# EasyEDA schematic GSE_Controller_Schematic25_EasyEDA.json
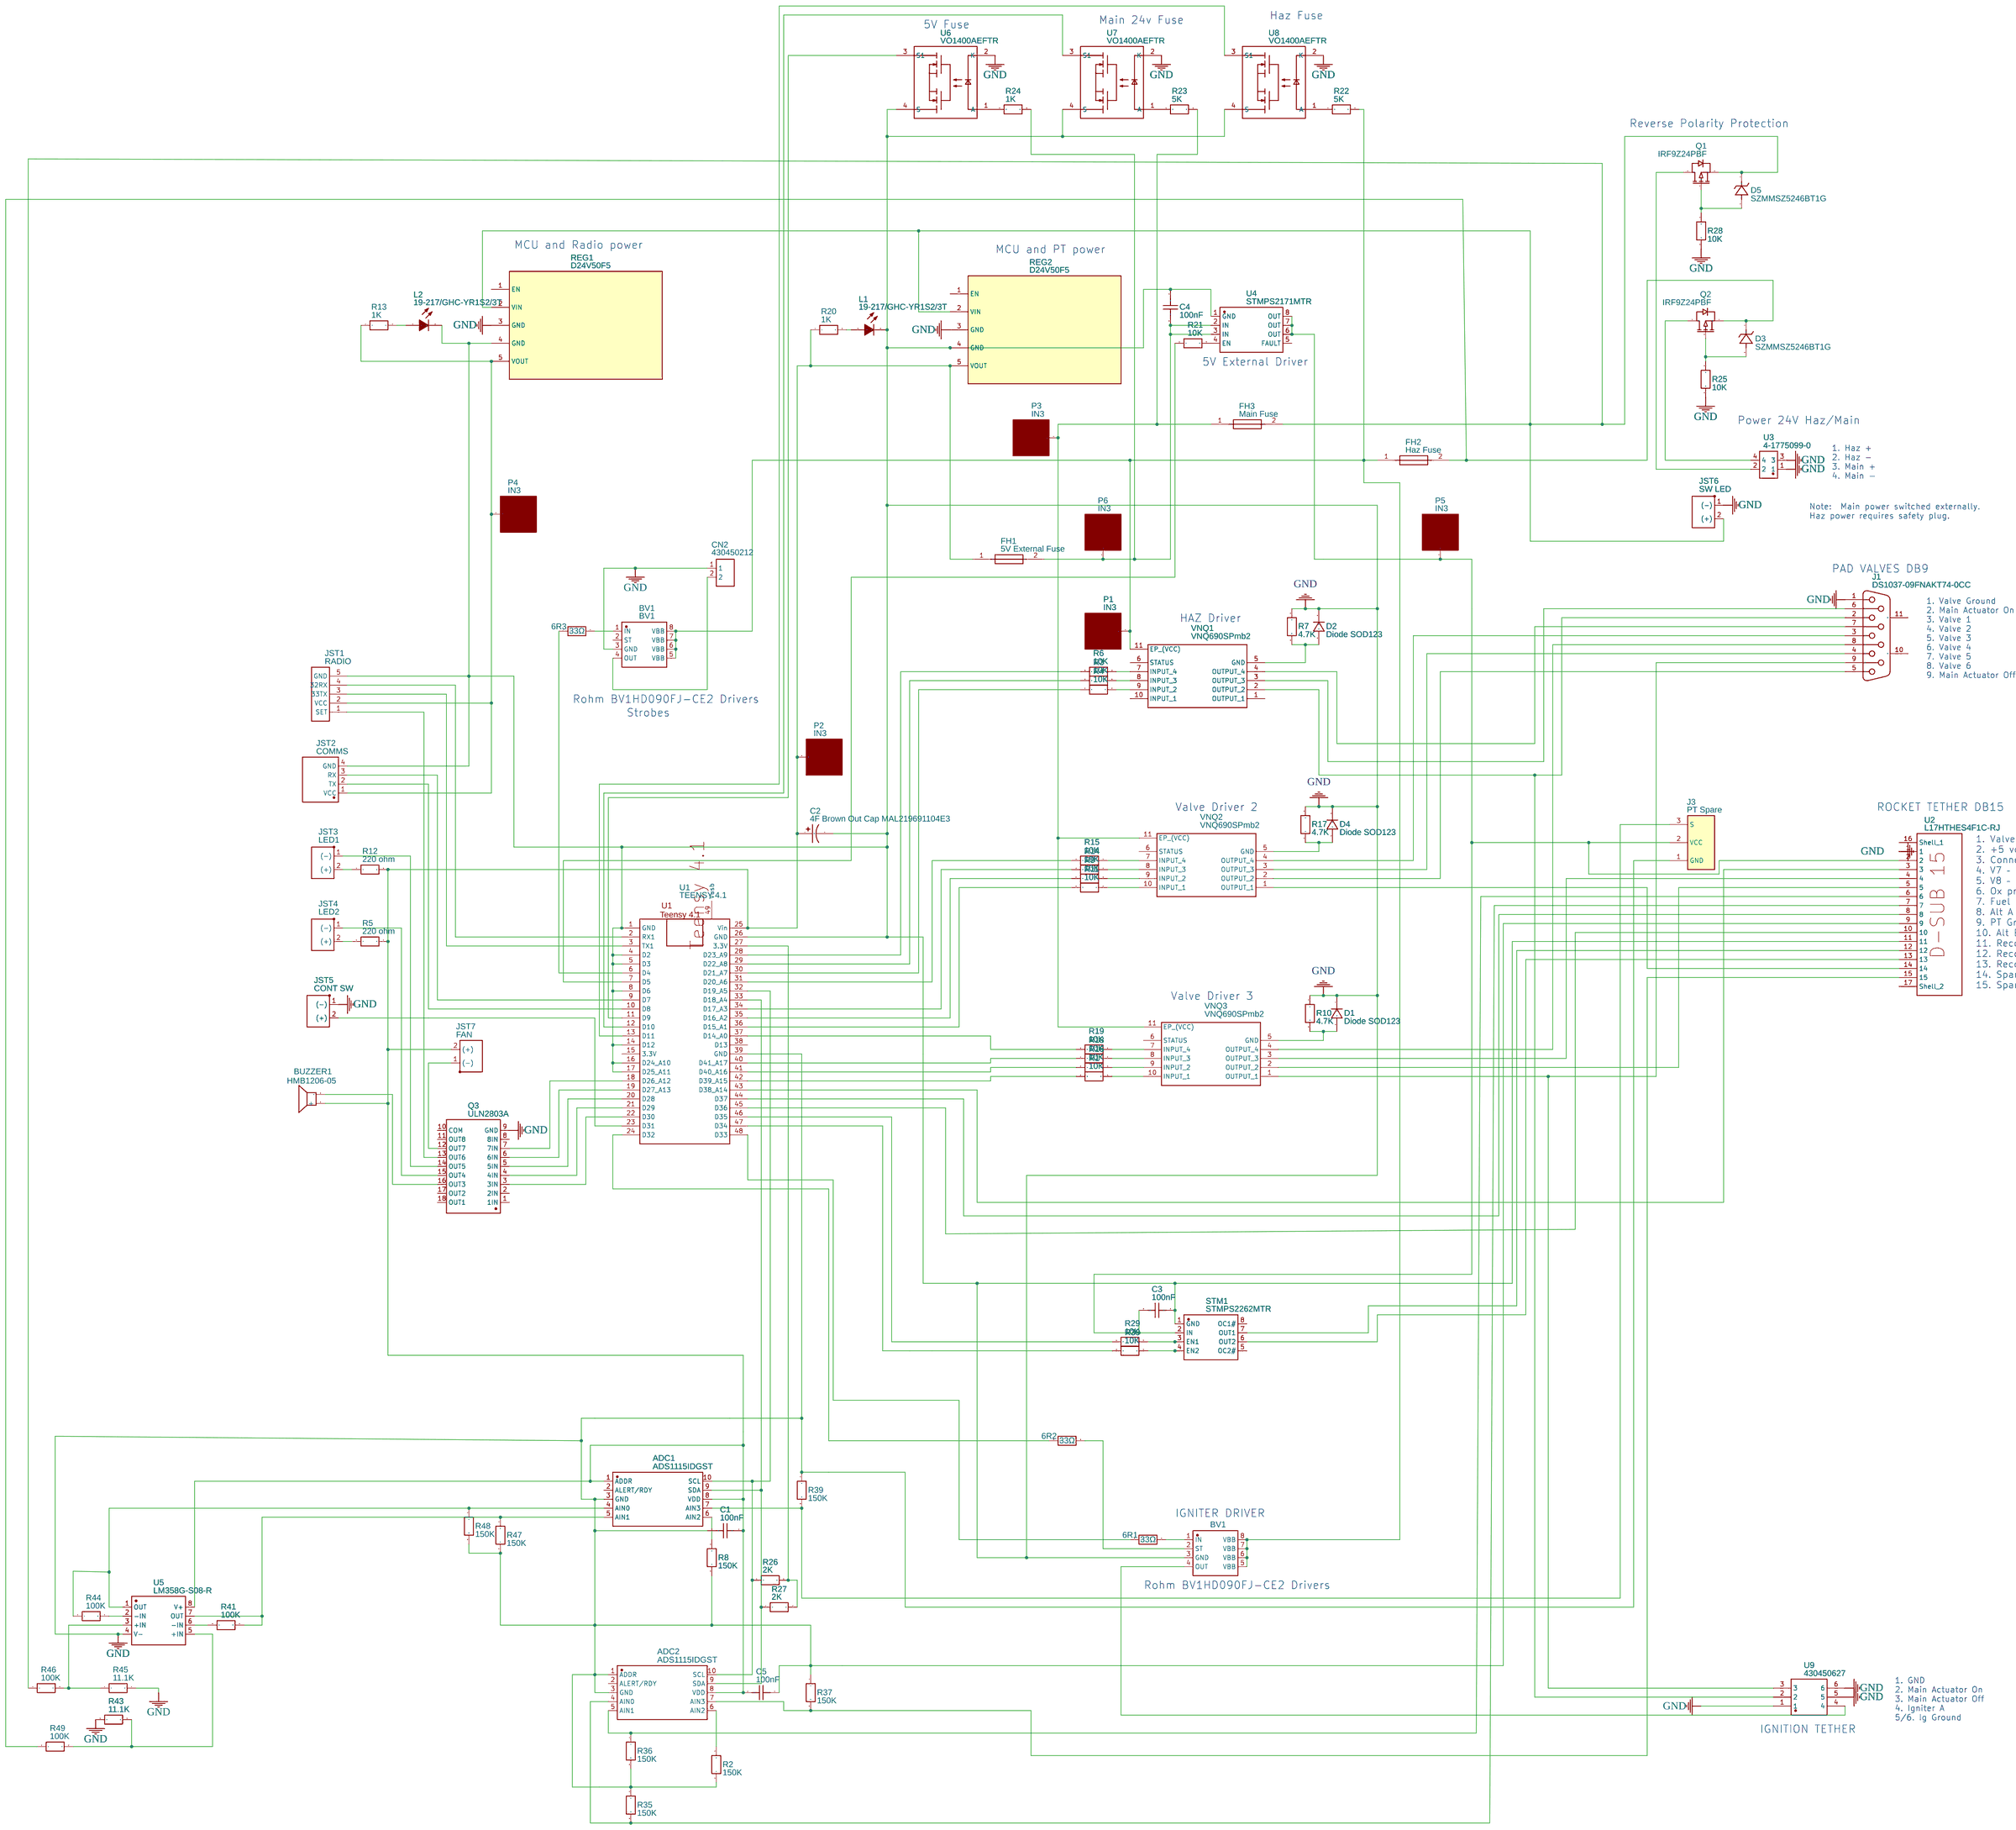
[diagram p0: schematic sheet]

## Parts
6R1  33Ω  [R0603]
6R2  33Ω  [R0603]
6R3  33Ω  [R0603]
ADC1  ADS1115IDGST  [VSSOP-10_L3.0-W3.0-P0.50-LS4.9-BL-2OZ]
ADC2  ADS1115IDGST  [VSSOP-10_L3.0-W3.0-P0.50-LS4.9-BL-2OZ]
BUZZER1  HMB1206-05  [BUZ-TH_BD12.0-P7.60-D0.6-FD]
BV1  BV1  [SOP-8_L4.9-W3.9-P1.27-LS6.0-BL]
BV2  BV1  [SOP-8_L4.9-W3.9-P1.27-LS6.0-BL]
C1  100nF  [C0402]
C2  4F Brown Out Cap MAL219691104E3  [CAP_ROUND_7.5MM]
C3  100nF  [C0402]
C4  100nF  [C0402]
C5  100nF  [C0402]
CN2  430450212  [CONN-TH_430450212]
D1  Diode SOD123  [SOD-123W_L2.9-W2.1-LS4.4-RD]
D2  Diode SOD123  [SOD-123W_L2.9-W2.1-LS4.4-RD]
D3  SZMMSZ5246BT1G  [SOD-123_L2.7-W1.6-LS3.7-RD-1]
D4  Diode SOD123  [SOD-123W_L2.9-W2.1-LS4.4-RD]
D5  SZMMSZ5246BT1G  [SOD-123_L2.7-W1.6-LS3.7-RD-1]
FH1  5V External Fuse  [LITTLEFUSE 01000063Z]
FH2  Haz Fuse  [LITTLEFUSE 01000063Z]
FH3  Main Fuse  [LITTLEFUSE 01000063Z]
J1  DS1037-09FNAKT74-0CC  [DSUB-TH_DS1037-09FNAKT74-0CC]
J3  PT Spare  [PH-3A]
JST1  RADIO  [JST-PH2.0-5PINS]
JST2  COMMS  [B4B-PH-K(LF)(SN)]
JST3  LED1  [JSTX2F]
JST4  LED2  [JSTX2F]
JST5  CONT SW  [JSTX2F]
JST6  SW LED  [JSTX2F]
JST7  FAN  [JSTX2F]
L1  19-217/GHC-YR1S2/3T  [LED0603-R-RD]
L2  19-217/GHC-YR1S2/3T  [LED0603-R-RD]
P1  IN3  [PAD_1.5X2.5]
P2  IN3  [PAD_1.5X2.5]
P3  IN3  [PAD_1.5X2.5]
P4  IN3  [PAD_1.5X2.5]
P5  IN3  [PAD_1.5X2.5]
P6  IN3  [PAD_1.5X2.5]
Q1  IRF9Z24PBF  [TO-220AB-3_L10.4-W4.6-P2.54-L]
Q2  IRF9Z24PBF  [TO-220AB-3_L10.4-W4.6-P2.54-L]
Q3  ULN2803A  [DIP-18_L23.0-W6.5-P2.54-LS7.6-BL]
R1  10K  [R0805]
R2  150K  [R0805]
R3  10K  [R0805]
R4  10K  [R0805]
R5  220 ohm  [R0805]
R6  10K  [R0805]
R7  4.7K  [R0805]
R8  150K  [R0805]
R9  10K  [R0805]
R10  4.7K  [R0805]
R11  10K  [R0805]
R12  220 ohm  [R0805]
R13  1K  [R0805]
R14  10K  [R0805]
R15  10K  [R0805]
R16  10K  [R0805]
R17  4.7K  [R0805]
R18  10K  [R0805]
R19  10K  [R0805]
R20  1K  [R0805]
R21  10K  [R0805]
R22  5K  [R0805]
R23  5K  [R0805]
R24  1K  [R0805]
R25  10K  [R0805]
R26  2K  [R0805]
R27  2K  [R0805]
R28  10K  [R0805]
R29  10K  [R0805]
R30  10K  [R0805]
R35  150K  [R0805]
R36  150K  [R0805]
R37  150K  [R0805]
R39  150K  [R0805]
R41  100K  [R0805]
R43  11.1K  [R0805]
R44  100K  [R0805]
R45  11.1K  [R0805]
R46  100K  [R0805]
R47  150K  [R0805]
R48  150K  [R0805]
R49  100K  [R0805]
REG1  D24V50F5  [D24V50F5]
REG2  D24V50F5  [D24V50F5]
STM1  STMPS2262MTR  [SO-8_L4.9-W3.9-P1.27-LS6.0-BL]
U1  TEENSY 4.1  [TEENSY 4.1]
U2  L17HTHES4F1C-RJ  [L17HTHES4F1C-RJ]
U3  4-1775099-0  [CONN-TH_4P-P4.20_TE_4-1775099-0]
U4  STMPS2171MTR  [SO-8_L4.9-W3.9-P1.27-LS6.0-BL]
U5  LM358G-S08-R  [SOIC-8_L5.0-W4.0-P1.27-LS6.0-BL]
U6  VO1400AEFTR  [SOP-4_L4.6-W4.4-P2.54-LS7.0-TL]
U7  VO1400AEFTR  [SOP-4_L4.6-W4.4-P2.54-LS7.0-TL]
U8  VO1400AEFTR  [SOP-4_L4.6-W4.4-P2.54-LS7.0-TL]
U9  430450627  [CONN-TH_430450627]
VNQ1  VNQ690SPmb2  [VNQ690SPMB]
VNQ2  VNQ690SPmb2  [VNQ690SPMB]
VNQ3  VNQ690SPmb2  [VNQ690SPMB]

## Library data of the parts
6R1-6R3 = SFR03EZPF1001: Supplier: LCSC; Supplier Part: C2941038; Manufacturer: ROHM(罗姆); Contributor: lcsc
ADC1 ADC2 = ADS1115IDGST: Supplier: LCSC; Supplier Part: C468683; Manufacturer: Texas Instruments; Contributor: LCSC; JLCPCB Part Class: Extended Part
BUZZER1 = HMB1206-05: Supplier: LCSC; Manufacturer: HNDZ; Supplier Part: C96095; LCSC Assembly: Yes; SMT Type: Extend; Assembly Type: manualWeld; Paste Type: expand
BV1 BV2 = BV1HD090FJ-CE2: Supplier: LCSC; Supplier Part: C2150182; Manufacturer: ROHM(罗姆); Contributor: LCSC; JLCPCB Part Class: Extended Part
C1 C3-C5 = CC0402KRX7R6BB104: Supplier: LCSC; Supplier Part: C309458; Manufacturer: YAGEO; Contributor: LCSC; SMT Type: Extend; JLCPCB SMD: Yes; LCSC Assembly: Yes; Paste Type: expand
C2 = C_Tan_SMD_A_US: Contributor: LCEDA_Lib
CN2 = 430450212: Contributor: LCSC; Supplier: LCSC; Supplier Part: C293362; Manufacturer: MOLEX; JLCPCB Part Class: Extended Part; link: https://lcsc.com/eda_search?q=C293362&%26type=1&ref=editor
D1 D2 D4 = S15MLW RVG: Supplier: LCSC; Supplier Part: C483951; Manufacturer: Taiwan Semiconductor(Taiwan Semicon); Contributor: LCSC; JLCPCB Part Class: Extended Part
D3 D5 = SZMMSZ5246BT1G: Contributor: LCSC; Supplier: LCSC; Supplier Part: C513075; Manufacturer: onsemi(安森美); JLCPCB Part Class: Extended Part; link: https://lcsc.com/eda_search?q=C513075&%26type=1&ref=editor
FH1-FH3 = Mini Blade Fuse Holder: Supplier: LCSC; Supplier Part: 01000063Z; Manufacturer: Littlefuse; Manufacturer Part: 01000063Z; Contributor: Bob11746; JLCPCB Part Class: Extended Part
J1 = DS1037-09FNAKT74-0CC: Supplier: LCSC; Manufacturer: CONNFLY; Supplier Part: C75749; JLCPCB Part Class: Extended Part
J3 = -: Supplier: LCSC; Manufacturer: JST; Manufacturer Part: B3B-PH-K-S(LF)(SN); Contributor: LCSC; Supplier Part: C131339
JST1 = JST-PH2.0-5PINS: Contributor: alieksieiev.yurii
JST2 = -: Supplier: LCSC; Supplier Part: C265289; Manufacturer: JST Sales America; Contributor: LCSC
JST3-JST7 = JST2X: Contributor: mbrinker
L1 L2 = 19-217/GHC-YR1S2/3T: Supplier: LCSC; Manufacturer: EVERLIGHT; image: //image.lceda.cn/szlcsc/C72043.jpg; Supplier Part: C72043; SMT Type: Basic; JLCPCB SMD: Yes; LCSC Assembly: Yes; Paste Type: base
P1-P6 = Solder Pad: Manufacturer Part: Soldering pad; Supplier Part: undefined; Contributor: Michael Gronlund
Q1 Q2 = IRF9Z24PBF: Contributor: LCSC; Supplier: LCSC; Supplier Part: C727675; Manufacturer: VISHAY(威世); JLCPCB Part Class: Extended Part; link: https://lcsc.com/eda_search?q=C727675&%26type=1&ref=editor
Q3 = ULN2803A: Supplier: LCSC; Manufacturer: STMicroelectronics; Supplier Part: C73936; Assembly Type: manualWeld; Paste Type: expand
R1-R30 R35-R37 R39 R41 R43-R49 = ERJP06J221V: Supplier: LCSC; Supplier Part: C417010; Manufacturer: PANASONIC; Contributor: LCSC
REG1 REG2 = D24V50F5: Contributor: winter2015; sourceId: YsmgyP7pj
STM1 = STMPS2262MTR: Supplier: LCSC; Supplier Part: C2150265; Manufacturer: ST(意法半导体); Contributor: LCSC
U1 = TEENSY 4.1: Contributor: cagoldwater
U2 = L17HTHES4F1C-RJ: Contributor: dropTarget
U3 = 4-1775099-0: Contributor: lcsc; Supplier: LCSC; Supplier Part: C5164039; Manufacturer: TE Connectivity(美国泰科); link: https://lcsc.com/eda_search?q=C5164039&%26type=1&ref=editor
U4 = STMPS2171MTR: Contributor: LCSC; Supplier: LCSC; Supplier Part: C2150330; Manufacturer: ST(意法半导体); JLCPCB Part Class: Extended Part; link: https://lcsc.com/eda_search?q=C2150330&%26type=1&ref=editor
U5 = LM358G-S08-R: Supplier: LCSC; Manufacturer: UTC; Supplier Part: C71101; JLCPCB Part Class: Extended Part
U6-U8 = VO1400AEFTR: Contributor: LCSC; Supplier: LCSC; Manufacturer: VISHAY(威世); Supplier Part: C142551; JLCPCB Part Class: Extended Part; link: https://lcsc.com/eda_search?q=C142551&%26type=1&ref=editor
U9 = 430450627: Contributor: LCSC; Supplier: LCSC; Supplier Part: C293538; Manufacturer: MOLEX; JLCPCB Part Class: Extended Part; link: https://lcsc.com/eda_search?q=C293538&%26type=1&ref=editor
VNQ1-VNQ3 = VNQ690SPmb2: Contributor: mbrinker

## Nets
GND: ADC1.3(GND) ADC2.1(ADDR) ADC2.3(GND) BV1.3(GND) BV2.3(GND) C1.2 C2.2 C3.1 C4.1 C5.1 CN2.1 D1.1 D2.1 D4.1 J1.1 J3.1(GND) JST1.5(GND) JST2.4(GND) JST5.1((-)) JST6.1((-)) L1.2(C) L2.2(C) Q3.9(GND) R2.2 R7.1 R8.2 R10.1 R17.1 R25.2 R28.2 R35.1 R36.2 R37.1 R39.1 R43.1 R45.2 R47.2 R48.2 REG1.3(GND) REG1.4(GND) REG2.3(GND) REG2.4(GND) STM1.1(GND) U1.1(GND) U1.4(D2) U1.5(D3) U1.8(D6) U1.14(D12) U1.16(D24 A10) U1.17(D25 A11) U1.26(GND) U1.39(GND) U2.1 U2.9 U2.11 U3.1 U3.3 U4.1(GND) U5.4(V-) U6.2(K) U6.4(S) U7.2(K) U7.4(S) U8.2(K) U8.4(S) U9.1 U9.5 U9.6
Net-(6R1-1): 6R1.1 U1.48(D33)
Net-(6R1-2): 6R1.2 BV2.1(IN)
Net-(6R2-1): 6R2.1 U1.24(D32)
Net-(6R2-2): 6R2.2 BV2.2(ST)
Net-(6R3-1): 6R3.1 U1.6(D4)
Net-(6R3-2): 6R3.2 BV1.1(IN)
Net-(ADC1-1): ADC1.1(ADDR) ADC1.8(VDD) ADC2.8(VDD) BUZZER1.1(+) C1.1 C2.1 C5.2 FH1.1 JST7.2((+)) P2.1 R5.2 R12.2 R20.1 REG2.5(VOUT) U1.25(Vin) U5.8(V+)
Net-(ADC1-4): ADC1.4(AIN0) R44.1 R48.1 U5.1(OUT)
Net-(ADC1-5): ADC1.5(AIN1) R41.2 R47.1 U5.7(OUT)
Net-(ADC1-6): ADC1.6(AIN2) R8.1
Net-(ADC1-7): ADC1.7(AIN3) J3.3(S) R39.2
Net-(ADC1-9): ADC1.9(SDA) ADC2.9(SDA) R27.1 U1.33(D18 A4)
Net-(ADC1-10): ADC1.10(SCL) ADC2.10(SCL) R26.1 U1.32(D19 A5)
Net-(ADC2-4): ADC2.4(AIN0) R35.2 U2.7
Net-(ADC2-5): ADC2.5(AIN1) R36.1 U2.6
Net-(ADC2-6): ADC2.6(AIN2) R2.1
Net-(ADC2-7): ADC2.7(AIN3) R37.2 U2.15
Net-(BUZZER1-2): BUZZER1.2 Q3.16(OUT3)
Net-(BV1-4): BV1.4(OUT) CN2.2
Net-(BV1-5): BV1.5(VBB) BV1.6(VBB) BV1.7(VBB) BV1.8(VBB) BV2.5(VBB) BV2.6(VBB) BV2.7(VBB) BV2.8(VBB) FH2.1 P1.1 R22.2 VNQ1.11(EP_(VCC))
Net-(BV2-4): BV2.4(OUT) U9.4
Net-(C3-2): C3.2 J3.2(VCC) P5.1 STM1.2(IN) U2.2 U4.6(OUT) U4.7(OUT) U4.8(OUT)
Net-(C4-2): C4.2 FH1.2 P6.1 R24.2 U4.2(IN) U4.3(IN)
Net-(D1-2): D1.2 R10.2 VNQ3.5(GND)
Net-(D2-2): D2.2 R7.2 VNQ1.5(GND)
Net-(D3-1): D3.1(C) FH2.2 Q2.3(S) R49.1
Net-(D3-2): D3.2(A) Q2.1(G) R25.1
Net-(D4-2): D4.2 R17.2 VNQ2.5(GND)
Net-(D5-1): D5.1(C) FH3.2 JST6.2((+)) Q1.3(S) R46.1 REG1.2(VIN) REG2.2(VIN)
Net-(D5-2): D5.2(A) Q1.1(G) R28.1
Net-(FH3-1): FH3.1 P3.1 R23.2 VNQ2.11(EP_(VCC)) VNQ3.11(EP_(VCC))
Net-(J1-2): J1.2 U9.2 VNQ1.2(OUTPUT)
Net-(J1-3): J1.3 VNQ2.4(OUTPUT)
Net-(J1-4): J1.4 VNQ2.3(OUTPUT)
Net-(J1-5): J1.5 VNQ2.2(OUTPUT)
Net-(J1-6): J1.6 VNQ1.3(OUTPUT)
Net-(J1-7): J1.7 VNQ1.4(OUTPUT)
Net-(J1-8): J1.8 VNQ3.4(OUTPUT)
Net-(J1-9): J1.9 U9.3 VNQ3.1(OUTPUT)
Net-(JST1-1): JST1.1(SET) Q3.13(OUT6)
Net-(JST1-2): JST1.2(VCC) JST2.1(VCC) P4.1 R13.1 REG1.5(VOUT)
Net-(JST1-3): JST1.3(33TX) U1.3(TX1)
Net-(JST1-4): JST1.4(32RX) U1.2(RX1)
Net-(JST2-2): JST2.2(TX) U1.10(D8)
Net-(JST2-3): JST2.3(RX) U1.9(D7)
Net-(JST3-1): JST3.1((-)) Q3.14(OUT5)
Net-(JST3-2): JST3.2((+)) R12.1
Net-(JST4-1): JST4.1((-)) Q3.15(OUT4)
Net-(JST4-2): JST4.2((+)) R5.1
Net-(JST5-2): JST5.2((+)) U1.23(D31)
Net-(JST7-1): JST7.1((-)) Q3.12(OUT7)
Net-(L1-1): L1.1(A) R20.2
Net-(L2-1): L2.1(A) R13.2
Net-(Q1-2): Q1.2(D) U3.2
Net-(Q2-2): Q2.2(D) U3.4
Net-(Q3-3): Q3.3(3IN) U1.22(D30)
Net-(Q3-4): Q3.4(4IN) U1.21(D29)
Net-(Q3-5): Q3.5(5IN) U1.20(D28)
Net-(Q3-6): Q3.6(6IN) U1.19(D27 A13)
Net-(Q3-7): Q3.7(7IN) U1.18(D26 A12)
Net-(R1-1): R1.1 U1.42(D39 A15)
Net-(R1-2): R1.2 VNQ3.10(INPUT_1)
Net-(R3-1): R3.1 U1.29(D22 A8)
Net-(R3-2): R3.2 VNQ1.8(INPUT_3)
Net-(R4-1): R4.1 U1.30(D21 A7)
Net-(R4-2): R4.2 VNQ1.9(INPUT_2)
Net-(R6-1): R6.1 U1.28(D23 A9)
Net-(R6-2): R6.2 VNQ1.7(INPUT_4)
Net-(R9-1): R9.1 U1.35(D16 A2)
Net-(R9-2): R9.2 VNQ2.9(INPUT_2)
Net-(R11-1): R11.1 U1.36(D15 A1)
Net-(R11-2): R11.2 VNQ2.10(INPUT_1)
Net-(R14-1): R14.1 U1.34(D17 A3)
Net-(R14-2): R14.2 VNQ2.8(INPUT_3)
Net-(R15-1): R15.1 U1.31(D20 A6)
Net-(R15-2): R15.2 VNQ2.7(INPUT_4)
Net-(R16-1): R16.1 U1.41(D40 A16)
Net-(R16-2): R16.2 VNQ3.9(INPUT_2)
Net-(R18-1): R18.1 U1.40(D41 A17)
Net-(R18-2): R18.2 VNQ3.8(INPUT_3)
Net-(R19-1): R19.1 U1.37(D14 A0)
Net-(R19-2): R19.2 VNQ3.7(INPUT_4)
Net-(R21-1): R21.1 U1.7(D5)
Net-(R21-2): R21.2 U4.4(EN)
Net-(R22-1): R22.1 U8.1(A)
Net-(R23-1): R23.1 U7.1(A)
Net-(R24-1): R24.1 U6.1(A)
Net-(R26-2): R26.2 R27.2 U1.27(3.3V)
Net-(R29-1): R29.1 U1.46(D35)
Net-(R29-2): R29.2 STM1.3(EN1)
Net-(R30-1): R30.1 U1.47(D34)
Net-(R30-2): R30.2 STM1.4(EN2)
Net-(R41-1): R41.1 U5.6(-IN)
Net-(R43-2): R43.2 R49.2 U5.5(+IN)
Net-(R44-2): R44.2 U5.2(-IN)
Net-(R45-1): R45.1 R46.2 U5.3(+IN)
Net-(STM1-6): STM1.6(OUT2) U2.13
Net-(STM1-7): STM1.7(OUT1) U2.12
Net-(U1-11): U1.11(D9) U6.3(S1)
Net-(U1-12): U1.12(D10) U7.3(S1)
Net-(U1-13): U1.13(D11) U8.3(S1)
Net-(U1-43): U1.43(D38 A14) U2.3
Net-(U1-44): U1.44(D37) U2.8
Net-(U1-45): U1.45(D36) U2.10
Net-(U2-4): U2.4 VNQ3.3(OUTPUT)
Net-(U2-5): U2.5 VNQ3.2(OUTPUT)
Net-(U2-14): U2.14 VNQ2.1(OUTPUT)

Not connected (* = marked no-connect by the designer): ADC1 2(ALERT/RDY); ADC2 2(ALERT/RDY); BV1 2(ST); J1 10(MH1) 11(MH2); Q3 1(1IN) 2(2IN) 8(8IN) 10(COM) 11(OUT8) 17(OUT2) 18(OUT1); REG1 1(EN); REG2 1(EN); STM1 5(OC2#) 8(OC1#); U1 15(3.3V) 38(D13) 49(Vusb); U2 16(Shell 1) 17(Shell 2); U4 5(FAULT); VNQ1 1(OUTPUT) 6(STATUS) 10(INPUT_1); VNQ2 6(STATUS); VNQ3 6(STATUS)

## Notes on the sheet
- FUSE STATUS DETECT - OPTO ISOLATED
- Main 24v Fuse
- Haz Fuse
- 5V Fuse
- Reverse Polarity Protection
- MCU and Radio power
- MCU and PT power
- 5V External Driver
- Power 24V Haz/Main
- 1. Haz +
  2. Haz -
  3. Main +
  4. Main -
- Note:  Main power switched externally.
  Haz power requires safety plug.
- PAD VALVES DB9
- 1. Valve Ground
  2. Main Actuator On
  3. Valve 1
  4. Valve 2
  5. Valve 3
  6. Valve 4
  7. Valve 5
  8. Valve 6
  9. Main Actuator Off
- HAZ Driver
- Rohm BV1HD090FJ-CE2 Drivers
- Strobes
- Valve Driver 2
- ROCKET TETHER DB15
- 1. Valve Ground
  2. +5 vdc
  3. Connect detect (to Rec ground)
  4. V7 – Fuel rocket vent
  5. V8 – Ox rocket vent
  6. Ox pressure signal
  7. Fuel pressure signal
  8. Alt A armed
  9. PT Ground return
  10. Alt B armed
  11. Recovery ground/return
  12. Recovery On (pulse)
  13. Recovery Off (pulse)
  14. Spare Valve
  15. Spare PT4
- Valve Driver 3
- IGNITER DRIVER
- Rohm BV1HD090FJ-CE2 Drivers
- 1. GND
  2. Main Actuator On
  3. Main Actuator Off
  4. Igniter A
  5/6. Ig Ground
- IGNITION TETHER
